# Altium schematic sheet RS485_MODBUS.SchDoc: MODBUS RS485
size A4; Date: *******; ApprovedBy: *******; CheckedBy: None; Author: *******; CompanyName: *******; DrawnBy: Name; Engineer: *******; Organization: *******; Address1: *******; Address2: *******; Address3: *******; Address4: *******; DocumentNumber: Doc Num; Revision: *******; SheetNumber: 6; SheetTotal: 10; CurrentTime: *******; CurrentDate: *******; Time: *******; DocumentFullPathAndName: *******; DocumentName: *******; ModifiedDate: *******; ImagePath: *******; ProjectName: *******; Application_BuildNumber: *******
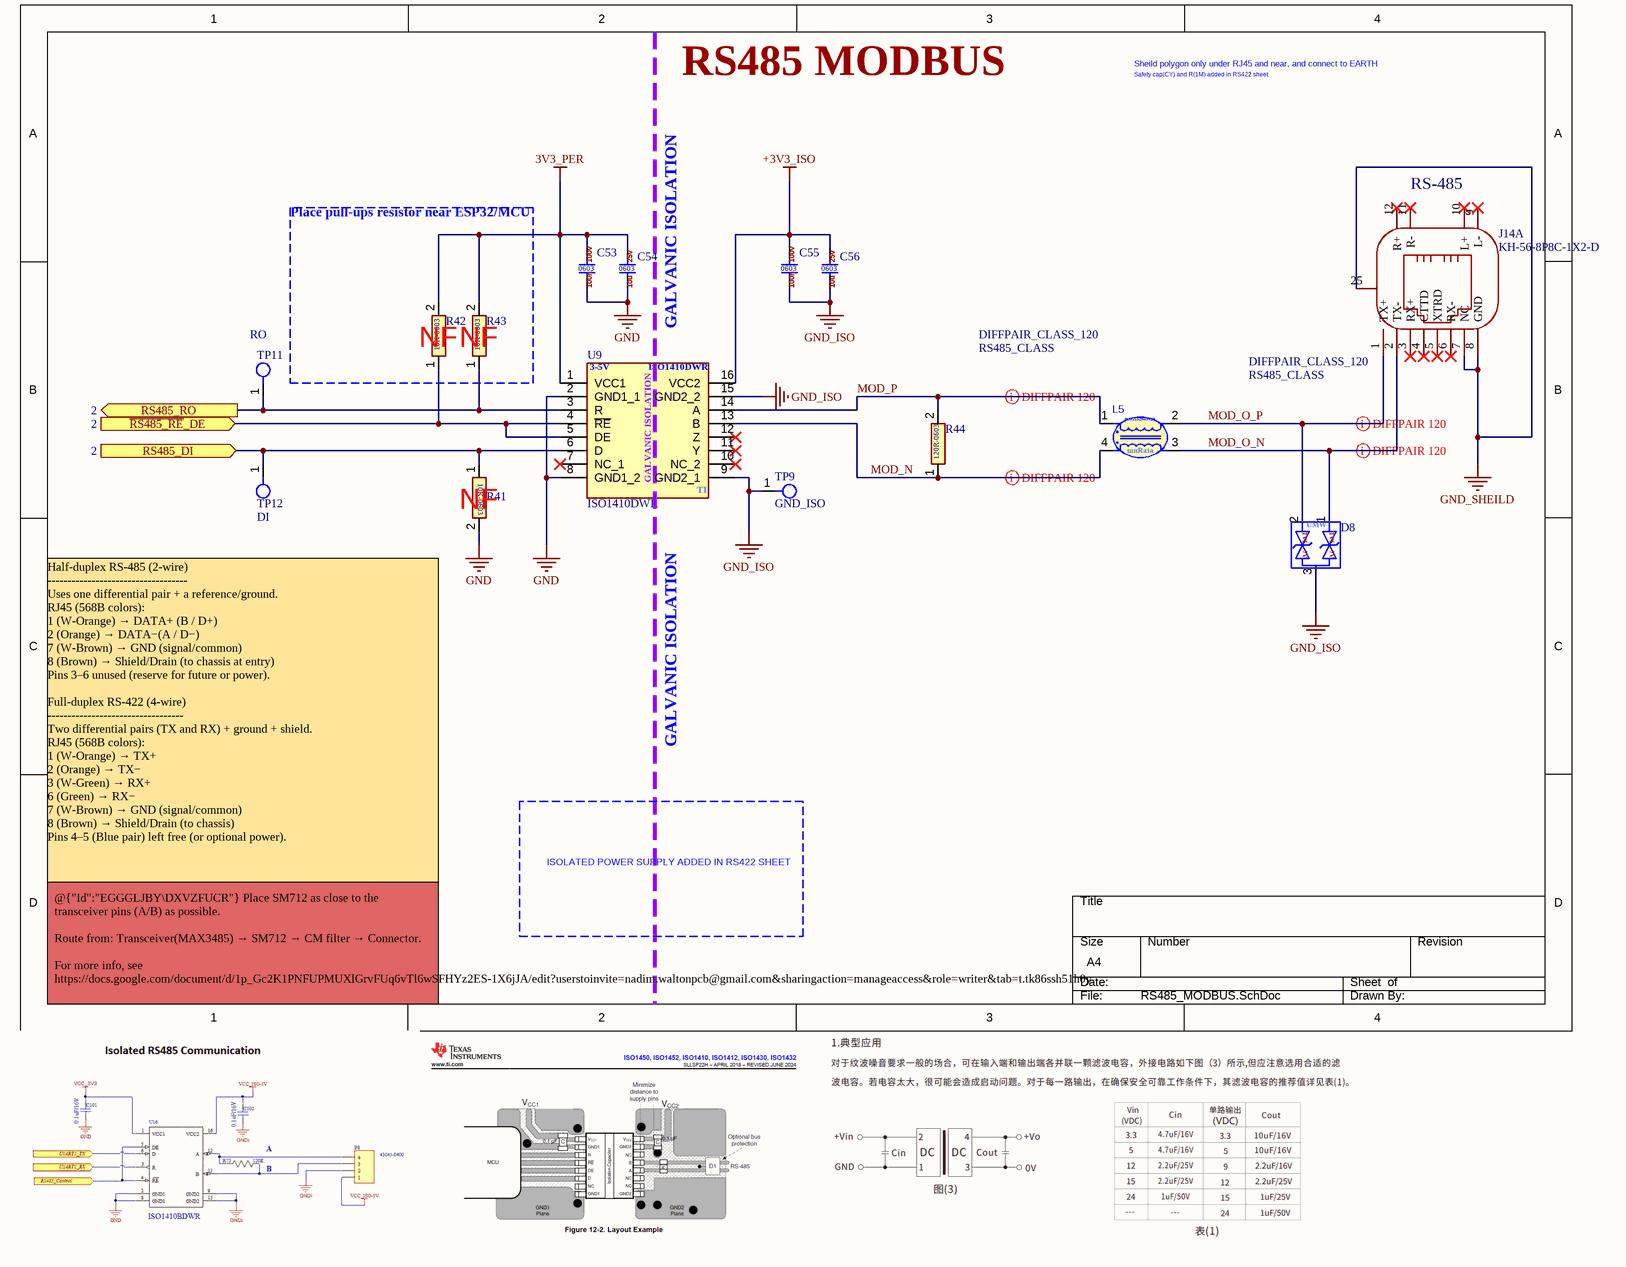
[diagram p0: RS485_MODBUS.SchDoc]

## Parts
C53  CL10B104KC8NNNC  [0603-CAP]  (value not drawn)
C54  CL10A106MA8NRNC  [0603-CAP]  (value not drawn)
C55  CL10B104KC8NNNC  [0603-CAP]  (value not drawn)
C56  CL10A106MA8NRNC  [0603-CAP]  (value not drawn)
D8  SM712(UMW)  [SOT-23-3]  (value not drawn)
J14  KH-56-8P8C-1X2-D  [RJ45-TH_KH-56-8P8C-1X2-D]  (part A of 2)
L5  DLW21SZ900HQ2L  [FILTER-SMD_4P-L2.0-W1.2-BL_DLW21H]  (value not drawn)
R41  0603WAF1002T5E  [0603-RES]  (value not drawn)
R42  0603WAF1002T5E  [0603-RES]  (value not drawn)
R43  0603WAF1002T5E  [0603-RES]  (value not drawn)
R44  0603WAF1200T5E  [0603-RES]  (value not drawn)
TP9  GND_ISO  [Test Pad FP]
TP11  RO  [Test Pad FP]
TP12  DI  [Test Pad FP]
U9  ISO1410DWR  [SOIC-16-300mil]

## Ports
RS485_DI (in, see 2), RS485_RO (out, see 2), ~{RS485_RE}_DE (in, see 2)

## Nets
3V3_PER: C53.2 C54.2 R42.2 R43.2 U9.1(VCC1)
+3V3_ISO: C55.2 C56.2 U9.16(VCC2)
GND: C53.1 C54.1 R41.2 U9.2(GND1_1) U9.8(GND1_2)
GND_ISO: C55.1 C56.1 D8.3 TP9.1 U9.9(GND2_1) U9.15(GND2_2)
GND_SHEILD: J14.7(NC) J14.8(GND) J14.25(SHELL)
MOD_N: L5.4 R44.1 U9.13(B)
MOD_O_N: D8.1 J14.2(TX-) L5.3
MOD_O_P: D8.2 J14.1(TX+) L5.2
MOD_P: L5.1 R44.2 U9.14(A)
~{RS485_RE}_DE: R42.1 U9.4(~{RE}) U9.5(DE) ; port ~{RS485_RE}_DE
RS485_DI: R41.1 TP12.1 U9.6(D) ; port RS485_DI
RS485_RO: R43.1 TP11.1 U9.3(R) ; port RS485_RO

Not connected (* = marked no-connect by the designer): J14 3(RX+)* 4(CTTD)* 5(XTRD)* 6(RX-)* 9(L-)* 10(L+)* 11(R-)* 12(R+)*; U9 7(NC_1)* 10(NC_2)* 11(Y)* 12(Z)*

## Layout directives
differential pair; differential pair class DIFFPAIR_CLASS_120; net class RS485_CLASS; rule Matched Net Lengths [Tolerance = 0.5mm]: MOD_N, MOD_O_N, MOD_O_P, MOD_P

## Notes on the sheet
- RS485 MODBUS
- Sheild polygon only under RJ45 and near, and connect to EARTH
- Safety cap(CY) and R(1M) added in RS422 sheet
- Place pull-ups resistor near ESP32/MCU
- (near J14) RS-485
- (near R42) NF
- (near R43) NF
- GALVANIC ISOLATION
- (near R41) NF
- Half-duplex RS-485 (2-wire)
  -----------------------------------
  Uses one differential pair + a reference/ground.
  RJ45 (568B colors):
  1 (W-Orange) → DATA+ (B / D+)
  2 (Orange) → DATA−(A / D−)
  7 (W-Brown) → GND (signal/common)
  8 (Brown) → Shield/Drain (to chassis at entry)
  Pins 3–6 unused (reserve for future or power).
  Full-duplex RS-422 (4-wire)
  ----------------------------------
  Two differential pairs (TX and RX) + ground + shield.
  RJ45 (568B colors):
  1 (W-Orange) → TX+
  2 (Orange) → TX−
  3 (W-Green) → RX+
  6 (Green) → RX−
  7 (W-Brown) → GND (signal/common)
  8 (Brown) → Shield/Drain (to chassis)
  Pins 4–5 (Blue pair) left free (or optional power).
- ISOLATED POWER SUPPLY ADDED IN RS422 SHEET
- @{"Id":"EGGGLJBY\DXVZFUCR"} Place SM712 as close to the transceiver pins (A/B) as possible.
  Route from: Transceiver(MAX3485) → SM712 → CM filter → Connector.
  For more info, see https://docs.google.com/document/d/1p_Gc2K1PNFUPMUXlGrvFUq6vTl6wSFHYz2ES-1X6jJA/edit?userstoinvite=nadim.waltonpcb@gmail.com&sharingaction=manageaccess&role=writer&tab=t.tk86ssh51h0y
- DWG. NO.
- REV.
- SHT.
- THIS DOCUMENT AND THE DATA DISCLOSED HEREIN OR HEREWITH IS THE PROPERTY OF ALTIUM LIMITED AND MAY BE FREELY DISTRIBUTED IN WHOLE. NO RIGHTS ARE RESERVED OR EXPRESS OR IMPLIED WARANTEE GIVEN.
- REVISION
- DESCRIPTION
- DATE
- APPROVED
- ENG:
- APPROVALS
- PROJECT
- DSN:
- CHK:
- REFERENCE DOCUMENTS
- PROJECT REVISION:
- TITLE
- DOCUMENT REVISION:
- DESIGN ITEM:
- BOM:
- FAB DWG:
- PCB DWG:
- ASSY DWG:
- SCALE:
- SIZE
- B
- CAGE CODE
- FILE NAME
- DWG NO.
- SHEET
- OF
- REV
- (in symbol 0603WAF1002T5E) 10K-0603
- (in symbol 0603WAF1200T5E) 120R-0603
- (in symbol CL10A106MA8NRNC) 25v; 0603; 10u
- (in symbol CL10B104KC8NNNC) 100v; 0603; 100n
- (in symbol DLW21SZ900HQ2L) muRata
- (in symbol ISO1410DWR) 3-5V; GALVANIC ISOLATION; TI
- (in symbol SM712(UMW)) TVS; UMW; 7V

## Library data of the parts
C53 C55 = CL10B104KC8NNNC: CAP: CER 100NF 100V X7R 0603; POC Price: 0.006; LCSC Part #: C15725; Unit Price: 0.0036; ComponentLink1Description: DS; ComponentLink1URL: https://www.lcsc.com/datasheet/C15725.pdf
C54 C56 = CL10A106MA8NRNC: CAP: CER 10UF 25V X5R 0603; LCSC Part #: C96446; Unit Price: 0.01; ComponentLink1Description: DS; ComponentLink1URL: https://www.lcsc.com/datasheet/C96446.pdf
D8 = SM712(UMW): DIODE TVS: 7V WM 11VC Voltage - Breakdown (Min) 6V / SOT-23; LCSC Part #: C7436899; Unit Price: 0.0183; ComponentLink1Description: DS; ComponentLink1URL: https://www.lcsc.com/datasheet/C7436899.pdf
J14 = KH-56-8P8C-1X2-D_1: RJ45: RJ45 Jack 2 Shielded Right Angle With LED 0℃~+70℃ Through Hole,Right Angle Ethernet Connectors / Modular Connectors (RJ45 RJ11) ROHS; LCSC Part #: C2828088; Unit Price: 0.3505; ComponentLink1Description: DS; ComponentLink1URL: https://www.lcsc.com/datasheet/C2828088.pdf
L5 = DLW21SZ900HQ2L: Filter CM: 90Ω@100MHz 410mΩ 2 0805 Common Mode Filters ROHS; POC Price: 0.1002; LCSC Part #: C161093; Unit Price: 0.0475; ComponentLink1Description: DS; ComponentLink1URL: https://www.lcsc.com/datasheet/C161093.pdf
R41-R43 = 0603WAF1002T5E: RES: 10K OHM 1% 100mW 0603 75V; LCSC Part #: C25804; Unit Price: 0.0005; ComponentLink1Description: DS; ComponentLink1URL: https://www.lcsc.com/datasheet/C25804.pdf
R44 = 0603WAF1200T5E: RES: 120R OHM 1% 100mW 0603 75V; LCSC Part #: C22787; Unit Price: 0.0006; ComponentLink1Description: DS; ComponentLink1URL: https://www.lcsc.com/datasheet/C22787.pdf
TP9 TP11 TP12 = Test Pad: TESTPAD: Test Pad
U9 = ISO1410DWR: MODBUS: Galvanic Isolated 3-5V Full and Half-Duplex RS-485 RS-422 Transceivers; POC Price: 3.5376; LCSC Part #: C2671566; Unit Price: 2.1999; ComponentLink1Description: DS; ComponentLink1URL: https://www.ti.com/lit/ds/symlink/iso1410.pdf?ts=1756305081744&ref_url=https%253A%252F%252Fwww.ti.com%252Fproduct%252FISO1410%252Fpart-details%252FISO1410DWR